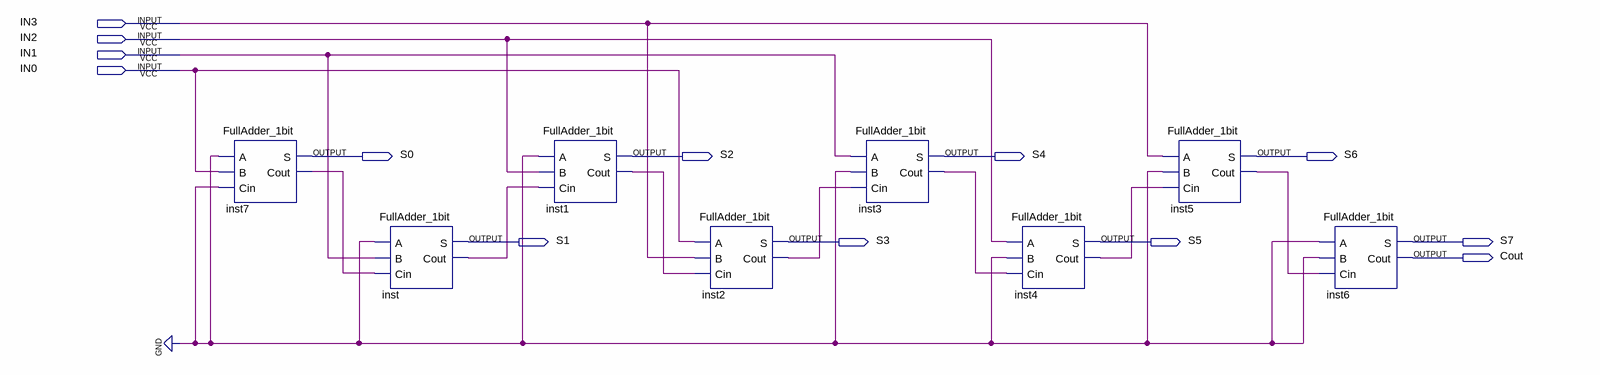
[diagram p0: schematic sheet]
// Quartus schematic Simple_4bit_Multiplier_9_Design.bdf as structural Verilog: 8 symbols, 13 pins
module Simple_4bit_Multiplier_9_Design (
  input  IN3,
  input  IN2,
  input  IN1,
  input  IN0,
  output S0,
  output S2,
  output S4,
  output S6,
  output S1,
  output S3,
  output S5,
  output S7,
  output Cout
);

  wire inst1_cout, inst2_cout, inst3_cout, inst4_cout, inst5_cout, inst7_cout, inst_cout;

  FullAdder_1bit inst7 (.A(1'b0), .B(IN0), .Cin(1'b0), .S(S0), .Cout(inst7_cout));
  FullAdder_1bit inst (.A(1'b0), .B(IN1), .Cin(inst7_cout), .S(S1), .Cout(inst_cout));
  FullAdder_1bit inst1 (.A(1'b0), .B(IN2), .Cin(inst_cout), .S(S2), .Cout(inst1_cout));
  FullAdder_1bit inst2 (.A(IN0), .B(IN3), .Cin(inst1_cout), .S(S3), .Cout(inst2_cout));
  FullAdder_1bit inst3 (.A(IN1), .B(1'b0), .Cin(inst2_cout), .S(S4), .Cout(inst3_cout));
  FullAdder_1bit inst4 (.A(IN2), .B(1'b0), .Cin(inst3_cout), .S(S5), .Cout(inst4_cout));
  FullAdder_1bit inst5 (.A(IN3), .B(1'b0), .Cin(inst4_cout), .S(S6), .Cout(inst5_cout));
  FullAdder_1bit inst6 (.A(1'b0), .B(1'b0), .Cin(inst5_cout), .S(S7), .Cout(Cout));
endmodule
